# EAGLE design Platinen-Adapter (EAGLE 7.4.0)
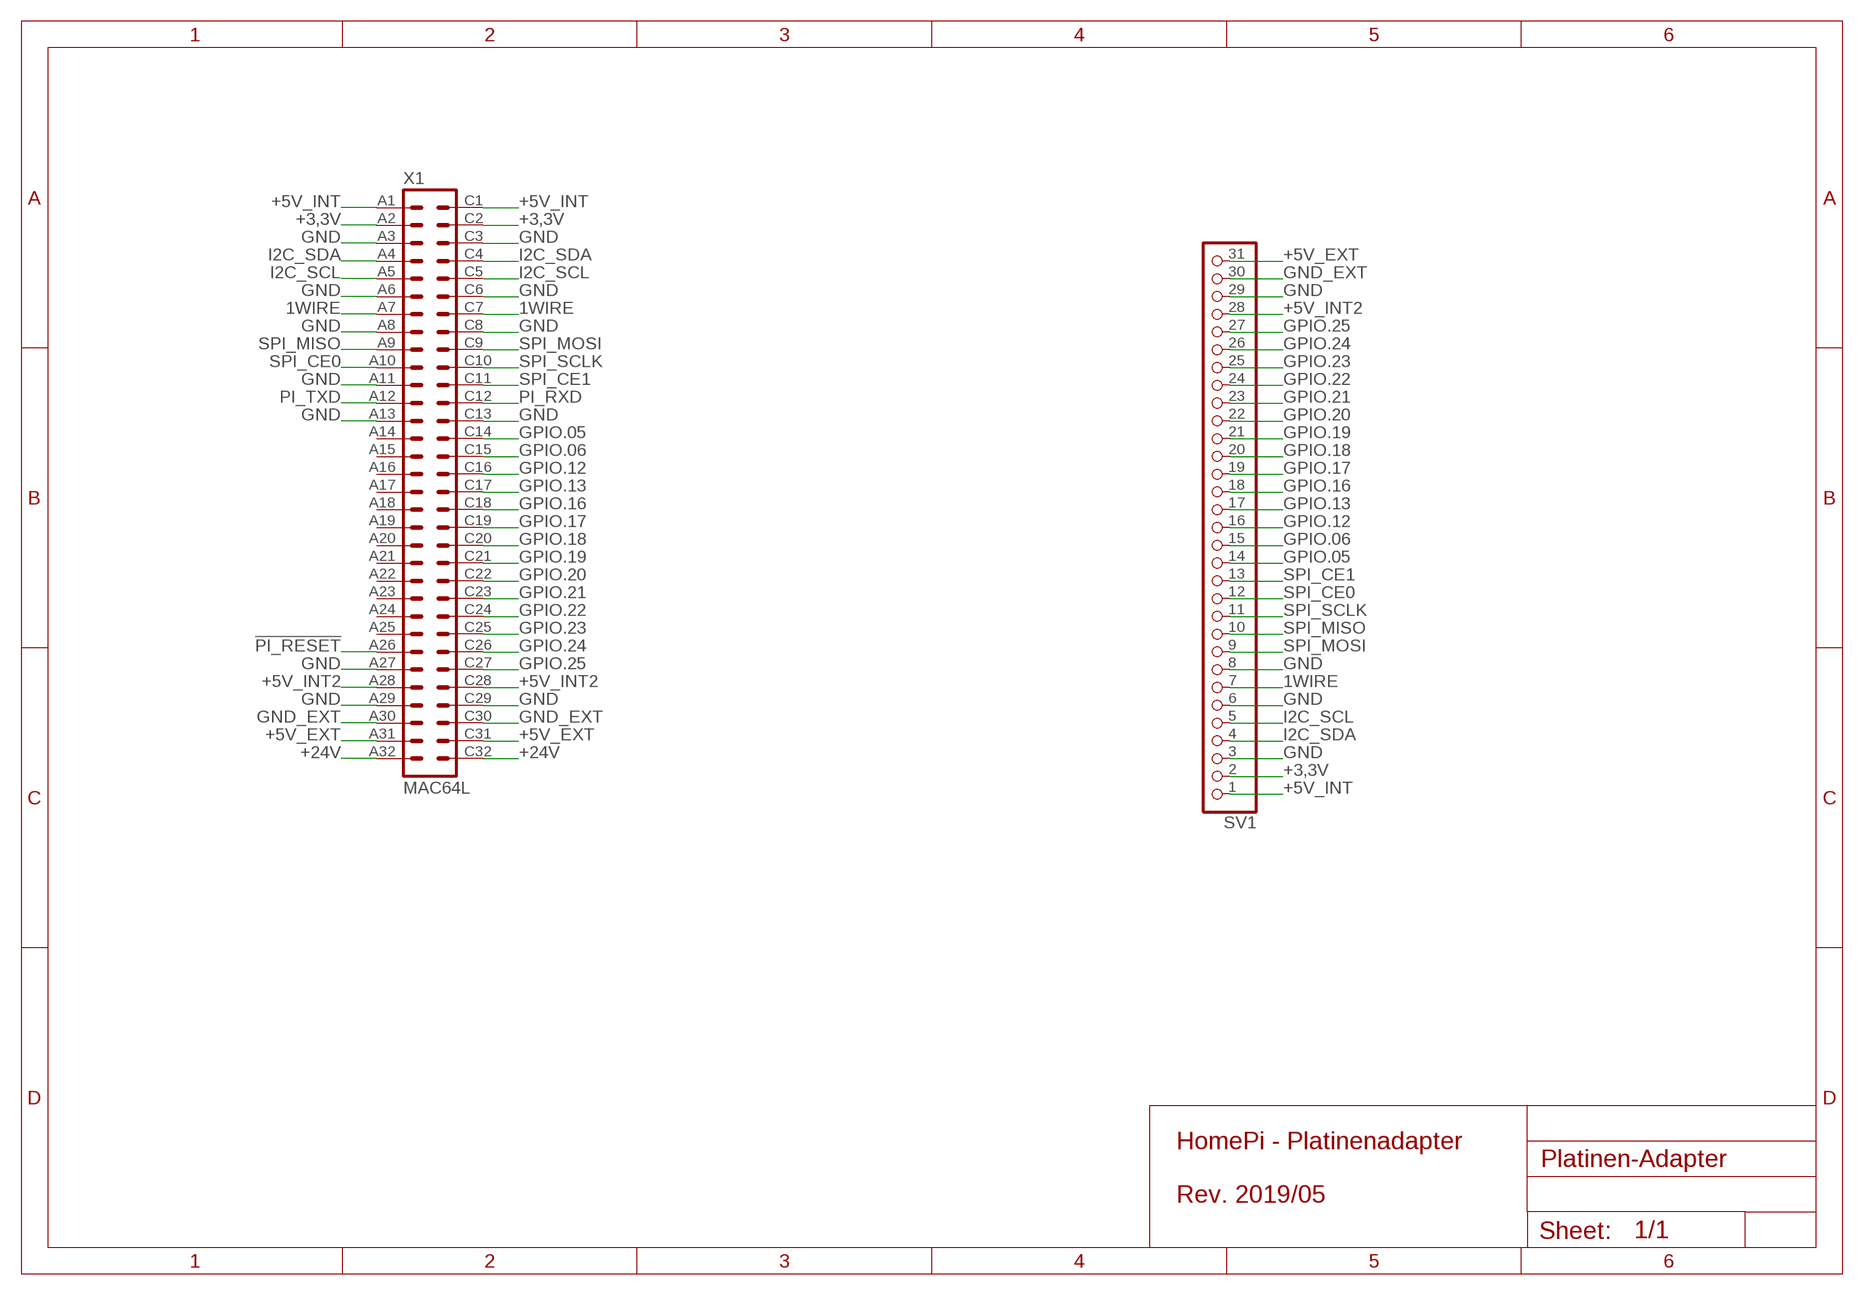
[diagram p0: schematic, sheet 1]

## Parts
SV1  PINHD-1X31  [1X31]
X1  MAC64L  [MAC64L]

## Nets
1WIRE: SV1.7 X1.A7 X1.C7
!PI_RESET: X1.A26
+3,3V: SV1.2 X1.A2 X1.C2
+5V_EXT: SV1.31 X1.A31 X1.C31
+5V_INT: SV1.1 X1.A1 X1.C1
+5V_INT2: SV1.28 X1.A28 X1.C28
+24V [24V]: X1.A32 X1.C32
GND: SV1.3 SV1.6 SV1.8 SV1.29 X1.A3 X1.A6 X1.A8 X1.A11 X1.A13 X1.A27 X1.A29 X1.C3 X1.C6 X1.C8 X1.C13 X1.C29
GND_EXT: SV1.30 X1.A30 X1.C30
GPIO.05: SV1.14 X1.C14
GPIO.06: SV1.15 X1.C15
GPIO.12: SV1.16 X1.C16
GPIO.13: SV1.17 X1.C17
GPIO.16: SV1.18 X1.C18
GPIO.17: SV1.19 X1.C19
GPIO.18: SV1.20 X1.C20
GPIO.19: SV1.21 X1.C21
GPIO.20: SV1.22 X1.C22
GPIO.21: SV1.23 X1.C23
GPIO.22: SV1.24 X1.C24
GPIO.23: SV1.25 X1.C25
GPIO.24: SV1.26 X1.C26
GPIO.25: SV1.27 X1.C27
I2C_SCL: SV1.5 X1.A5 X1.C5
I2C_SDA: SV1.4 X1.A4 X1.C4
PI_RXD: X1.C12
PI_TXD: X1.A12
SPI_CE0: SV1.12 X1.A10
SPI_CE1: SV1.13 X1.C11
SPI_MISO: SV1.10 X1.A9
SPI_MOSI: SV1.9 X1.C9
SPI_SCLK: SV1.11 X1.C10
Unconnected: X1.A14 X1.A15 X1.A16 X1.A17 X1.A18 X1.A19 X1.A20 X1.A21 X1.A22 X1.A23 X1.A24 X1.A25

## Notes on the sheet
- HomePi - Platinenadapter
  
  Rev. 2019/05

## Library data of the parts
SV1 = 64-pol-verbinder:PINHD-1X31: PIN HEADER
X1 = con-vg:MAC64L: CONNECTOR male, 64 pins, block, type C, rows AC, grid 5.08 mm

## Net classes
1 24V: width 0.813 mm, clearance 0.406 mm

## Board
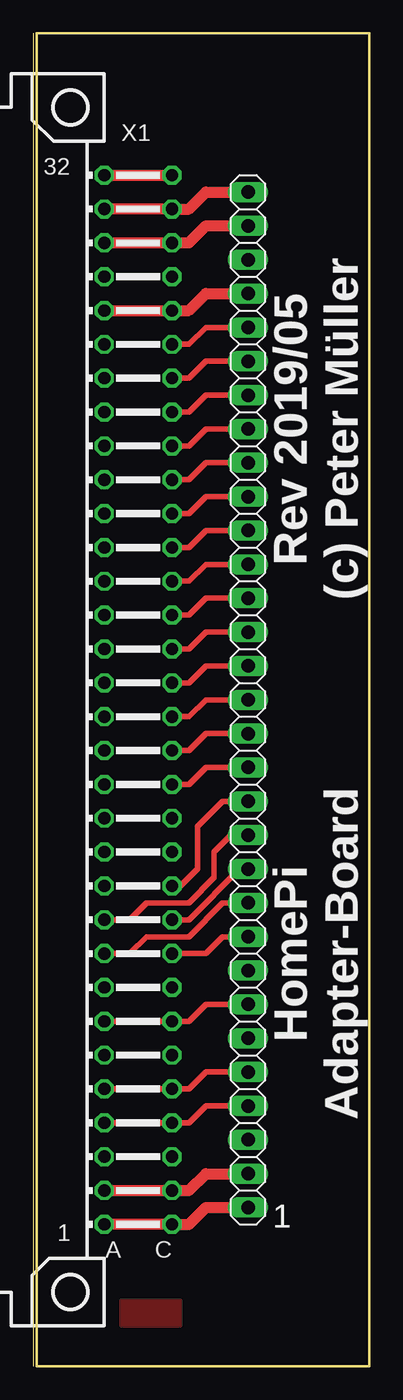
[diagram p1: board, top side]
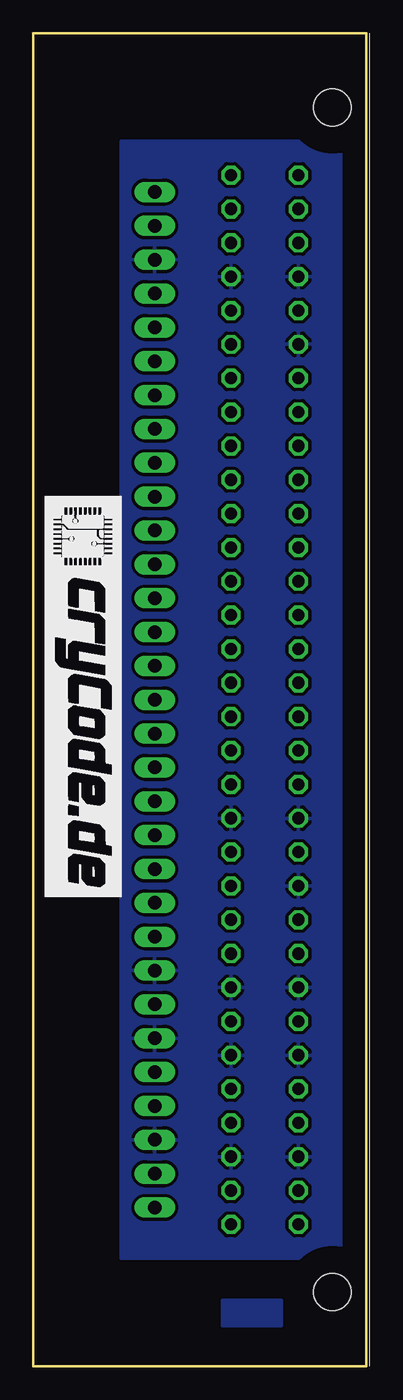
[diagram p2: board, bottom side, seen from below]

Size 25 x 100 mm. Coordinates in mm from the lower left corner, seen from the top.
Outline: 0,0 25,0 25,100 0,100 0,0
Copper layers (1*16): Top 0.035mm / dielectric 1.5mm / Bottom 0.035mm
Design rules "allpcb2": minimum track width 8mil, minimum drill 0.5mm, track to track 8mil, track to pad 8mil, pad to pad 8mil, via to via 8mil, smd to smd 6mil, copper to edge 40mil, drill to drill 8mil, minimum pad ring 10mil, minimum via ring 8mil, stop-mask expansion 0.1mm, vias tented up to drill 0mil, thermal gap 10mil

### Footprints (pad centres in the part's own frame; a part is rotated, then mirrored left to right if it is on the bottom)
1X31 = drill 1.016 long: 1 -36.83,0; 2 -34.29,0; 3 -31.75,0; 4 -29.21,0; 5 -26.67,0; 6 -24.13,0; 7 -21.59,0; 8 -19.05,0; 9 -16.51,0; 10 -13.97,0; 11 -11.43,0; 12 -8.89,0; 13 -6.35,0; 14 -3.81,0; 15 -1.27,0; 16 1.27,0; 17 3.81,0; 18 6.35,0; 19 8.89,0; 20 11.43,0; 21 13.97,0; 22 16.51,0; 23 19.05,0; 24 21.59,0; 25 24.13,0; 26 26.67,0; 27 29.21,0; 28 31.75,0; 29 34.29,0; 30 36.83,0; 31 39.37,0
MAC64L = drill 0.914 octagon: A1 -2.54,39.37; A2 -2.54,36.83; A3 -2.54,34.29; A4 -2.54,31.75; A5 -2.54,29.21; A6 -2.54,26.67; A7 -2.54,24.13; A8 -2.54,21.59; A9 -2.54,19.05; A10 -2.54,16.51; A11 -2.54,13.97; A12 -2.54,11.43; A13 -2.54,8.89; A14 -2.54,6.35; A15 -2.54,3.81; A16 -2.54,1.27; A17 -2.54,-1.27; A18 -2.54,-3.81; A19 -2.54,-6.35; A20 -2.54,-8.89; A21 -2.54,-11.43; A22 -2.54,-13.97; A23 -2.54,-16.51; A24 -2.54,-19.05; A25 -2.54,-21.59; A26 -2.54,-24.13; A27 -2.54,-26.67; A28 -2.54,-29.21; A29 -2.54,-31.75; A30 -2.54,-34.29; A31 -2.54,-36.83; A32 -2.54,-39.37; C1 -7.62,39.37; C2 -7.62,36.83; C3 -7.62,34.29; C4 -7.62,31.75; C5 -7.62,29.21; C6 -7.62,26.67; C7 -7.62,24.13; C8 -7.62,21.59; C9 -7.62,19.05; C10 -7.62,16.51; C11 -7.62,13.97; C12 -7.62,11.43; C13 -7.62,8.89; C14 -7.62,6.35; C15 -7.62,3.81; C16 -7.62,1.27; C17 -7.62,-1.27; C18 -7.62,-3.81; C19 -7.62,-6.35; C20 -7.62,-8.89; C21 -7.62,-11.43; C22 -7.62,-13.97; C23 -7.62,-16.51; C24 -7.62,-19.05; C25 -7.62,-21.59; C26 -7.62,-24.13; C27 -7.62,-26.67; C28 -7.62,-29.21; C29 -7.62,-31.75; C30 -7.62,-34.29; C31 -7.62,-36.83; C32 -7.62,-39.37 | hole 2.794: 0,44.45; 0,-44.45

### Placement (x,y rotation side)
SV1  15.88,48.73 90 top
U$2  [30MM]  24.13,65.24 270 bottom
X1  2.54,50 180 top

### Tracks (layer width: path | path; a pad name or v marks a point on that pad's centre or on a via)
1WIRE
  Top 0.406: X1.A7 X1.C7 11.43,25.87 12.7,27.14 SV1.7
+3,3V
  Top 0.813: SV1.2 12.7,14.44 11.43,13.17 X1.C2 X1.A2
+5V_EXT
  Top 0.813: X1.A31 X1.C31 11.43,86.83 12.7,88.1 SV1.31
+5V_INT
  Top 0.813: SV1.1 12.7,11.9 11.43,10.63 X1.C1 X1.A1
+5V_INT2
  Top 0.813: X1.A28 X1.C28 11.43,79.21 12.7,80.48 SV1.28
+24V
  Top 0.813: X1.A32 X1.C32
BOT
  pour Bottom: 6.35,4.92 10.79,4.92 10.79,3.01 6.35,3.01
GND
  pour Bottom (isolate 0.254): 1.91,91.91 18.41,91.91 18.41,8.09 1.91,8.09
GND_EXT
  Top 0.813: SV1.30 12.7,85.56 11.43,84.29 X1.C30 X1.A30
GPIO.05
  Top 0.406: X1.C14 11.43,43.65 12.7,44.92 SV1.14
GPIO.06
  Top 0.406: X1.C15 11.43,46.19 12.7,47.46 SV1.15
GPIO.12
  Top 0.406: X1.C16 11.43,48.73 12.7,50 SV1.16
GPIO.13
  Top 0.406: X1.C17 11.43,51.27 12.7,52.54 SV1.17
GPIO.16
  Top 0.406: X1.C18 11.43,53.81 12.7,55.08 SV1.18
GPIO.17
  Top 0.406: X1.C19 11.43,56.35 12.7,57.62 SV1.19
GPIO.18
  Top 0.406: X1.C20 11.43,58.89 12.7,60.16 SV1.20
GPIO.19
  Top 0.406: X1.C21 11.43,61.43 12.7,62.7 SV1.21
GPIO.20
  Top 0.406: X1.C22 11.43,63.97 12.7,65.24 SV1.22
GPIO.21
  Top 0.406: X1.C23 11.43,66.51 12.7,67.78 SV1.23
GPIO.22
  Top 0.406: X1.C24 11.43,69.05 12.7,70.32 SV1.24
GPIO.23
  Top 0.406: X1.C25 11.43,71.59 12.7,72.86 SV1.25
GPIO.24
  Top 0.406: X1.C26 11.43,74.13 12.7,75.4 SV1.26
GPIO.25
  Top 0.406: X1.C27 11.43,76.67 12.7,77.94 SV1.27
I2C_SCL
  Top 0.406: X1.A5 X1.C5 11.43,20.79 12.7,22.06 SV1.5
I2C_SDA
  Top 0.406: X1.A4 X1.C4 11.43,18.25 12.7,19.52 SV1.4
SPI_CE0
  Top 0.406: X1.A10 6.99,33.49 8.26,34.76 11.43,34.76 13.34,36.66 13.34,38.57 14.61,39.84 SV1.12
SPI_CE1
  Top 0.406: X1.C11 10.79,36.03 12.06,37.3 12.06,40.48 13.97,42.38 SV1.13
SPI_MISO
  Top 0.406: X1.A9 6.99,30.95 8.26,32.22 11.43,32.22 13.97,34.76 SV1.10
SPI_MOSI
  Top 0.406: X1.C9 12.7,30.95 13.97,32.22 SV1.9
SPI_SCLK
  Top 0.406: X1.C10 11.43,33.49 15.24,37.3 SV1.11
TOP
  pour Top: 6.35,4.92 10.79,4.92 10.79,3.01 6.35,3.01

### Text on the board
tNames: Rev 2019/05 / (c) Peter Müller | HomePi / Adapter-Board | 1
tRestrict: TOP
bRestrict: BOT